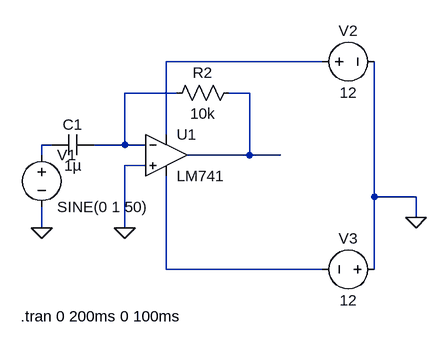
[diagram p0: schematic Differentiator.asc]
Differentiator.asc, the LTspice schematic file:
Version 4.1
SHEET 1 880 680
WIRE 320 0 80 0
WIRE 96 48 16 48
WIRE 208 48 176 48
WIRE 80 112 80 0
WIRE -96 128 -112 128
WIRE 16 128 16 48
WIRE 16 128 -32 128
WIRE 48 128 16 128
WIRE -112 144 -112 128
WIRE 208 144 208 48
WIRE 208 144 112 144
WIRE 256 144 208 144
WIRE 48 160 16 160
WIRE 400 208 400 0
WIRE 464 208 400 208
WIRE 464 240 464 208
WIRE -112 256 -112 224
WIRE 16 256 16 160
WIRE 80 320 80 176
WIRE 320 320 80 320
WIRE 400 320 400 208
FLAG -112 256 0
FLAG 16 256 0
FLAG 464 240 0
SYMBOL voltage -112 128 R0
WINDOW 123 0 0 Left 0
WINDOW 39 0 0 Left 0
SYMATTR InstName V1
SYMATTR Value SINE(0 1 50)
SYMBOL res 192 32 R90
WINDOW 0 0 56 VBottom 2
WINDOW 3 32 56 VTop 2
SYMATTR InstName R2
SYMATTR Value 10k
SYMBOL voltage 304 0 R270
WINDOW 0 32 56 VTop 2
WINDOW 3 -32 56 VBottom 2
WINDOW 123 0 0 Left 0
WINDOW 39 0 0 Left 0
SYMATTR InstName V2
SYMATTR Value 12
SYMBOL voltage 416 320 R90
WINDOW 0 -32 56 VBottom 2
WINDOW 3 32 56 VTop 2
WINDOW 123 0 0 Left 0
WINDOW 39 0 0 Left 0
SYMATTR InstName V3
SYMATTR Value 12
SYMBOL OpAmps\\LM741 80 80 R0
SYMATTR InstName U1
SYMBOL cap -32 112 R90
WINDOW 0 0 32 VBottom 2
WINDOW 3 32 32 VTop 2
SYMATTR InstName C1
SYMATTR Value 1µ
TEXT -144 392 Left 2 !.tran 0 200ms 0 100ms

The netlist it stands for:
* Differentiator.asc
V1 N004 0 SINE(0 1 50)
R2 N003 N002 10k
V2 N001 0 12
V3 0 N005 12
X§U1 0 N002 N001 N005 N003 LM741  ; pins In+ In- V+ V- OUT
C1 N002 N004 1µ
.tran 0 200ms 0 100ms
.lib LM741.lib
.backanno
.end